# Altium schematic sheet 精简版双路驱动.SchDoc
size A3
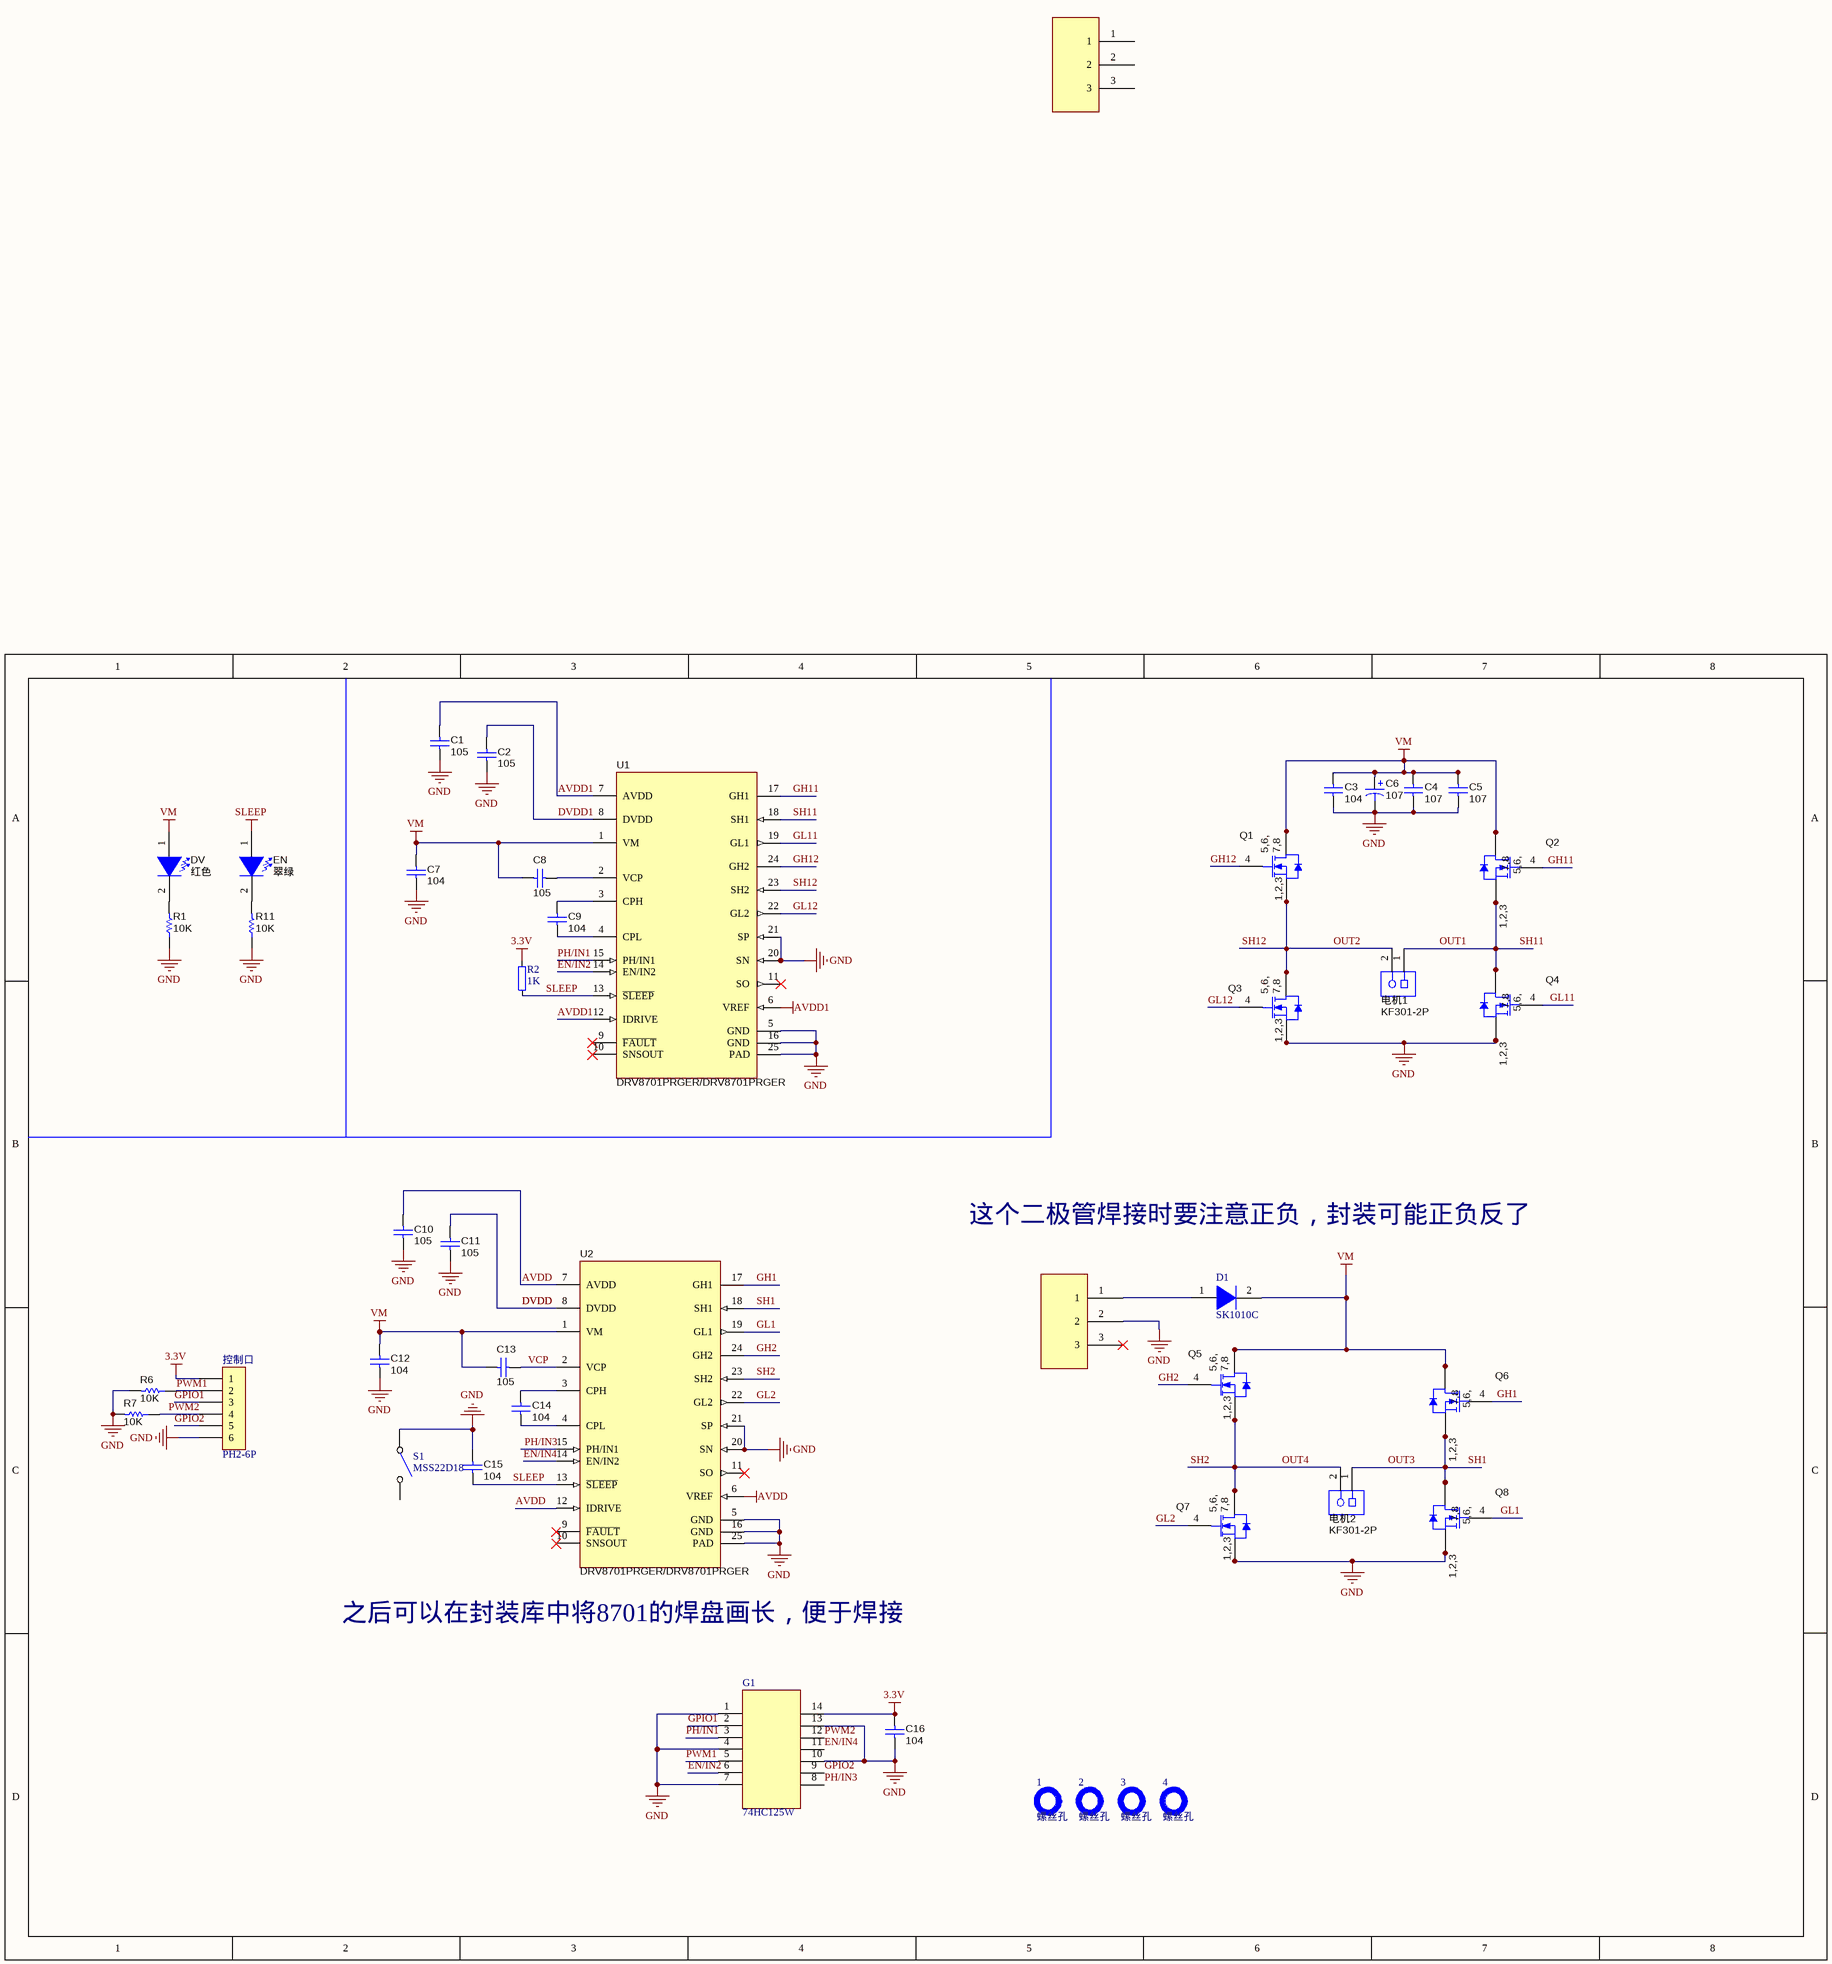
[diagram p0: 精简版双路驱动.SchDoc]

## Parts
(Parts that share a designator on the sheet are numbered #1, #2 ... from top to bottom, then left to right.)
1  螺丝孔  [LQ_SCROW3&5MM]
2  螺丝孔  [LQ_SCROW3&5MM]
3  螺丝孔  [LQ_SCROW3&5MM]
4  螺丝孔  [LQ_SCROW3&5MM]
*#1  DC接口  (value not drawn)  (part B of 2)
*#2  DC接口  (value not drawn)  (part A of 2)
C1  105  [LQ_C0603]
C2  105  [LQ_C0603]
C3  104  [LQ_C0603]
C4  107  [LQ_C1210]
C5  107  [LQ_C1210]
C6  107  [LQ_C1210]
C7  104  [LQ_C0603]
C8  105  [LQ_C0603]
C9  104  [LQ_C0603]
C10  105  [LQ_C0603]
C11  105  [LQ_C0603]
C12  104  [LQ_C0603]
C13  105  [LQ_C0603]
C14  104  [LQ_C0603]
C15  104  [LQ_C0603]
C16  104  [LQ_C0603]
D1  SK1010C  [LQ_DSMC-DO-214AB]
DV  红色  [LQ_LED0603R]
EN  翠绿  [LQ_LED0603R]
G1  74HC125W  [TSOP65P640X110-14N]
J1  DC接口  [DC-005]  (value not drawn)  (part B of 2)
Q1  TPH1R403NL/CSD18532Q5B  [LQ_SON5X6]  (value not drawn)
Q2  TPH1R403NL/CSD18532Q5B  [LQ_SON5X6]  (value not drawn)
Q3  TPH1R403NL/CSD18532Q5B  [LQ_SON5X6]  (value not drawn)
Q4  TPH1R403NL/CSD18532Q5B  [LQ_SON5X6]  (value not drawn)
Q5  TPH1R403NL/CSD18532Q5B  [LQ_SON5X6]  (value not drawn)
Q6  TPH1R403NL/CSD18532Q5B  [LQ_SON5X6]  (value not drawn)
Q7  TPH1R403NL/CSD18532Q5B  [LQ_SON5X6]  (value not drawn)
Q8  TPH1R403NL/CSD18532Q5B  [LQ_SON5X6]  (value not drawn)
R1  10K  [LQ_R0603]
R2  1K  [LQ_R0603]
R6  10K  [LQ_R0603]
R7  10K  [LQ_R0603]
R11  10K  [LQ_R0603]
S1  MSS22D18  [LQ_SW_MSS22D18]
U1  DRV8701PRGER/DRV8701PRGER  [RGE0024F]
U2  DRV8701PRGER/DRV8701PRGER  [RGE0024F]
控制口  PH2-6P  [LQ_PH2.0-WI-6P]
电机1  KF301-2P  [TX60-LI-S]
电机2  KF301-2P  [TX60-LI-S]

## Nets
3.3V: C16.1 G1.14 R2.2 控制口.1
AVDD: C10.1 U2.6(VREF) U2.7(AVDD) U2.12(IDRIVE)
AVDD1: C1.1 U1.6(VREF) U1.7(AVDD) U1.12(IDRIVE)
GND: C1.2 C2.2 C3.2 C4.2 C5.2 C6.2(-) C7.2 C10.2 C11.2 C12.2 C15.1 C16.2 G1.1 G1.4 G1.7 G1.10 G1.13 J1.2 Q3.1(S) Q3.2(S) Q3.3(S) Q4.1(S) Q4.2(S) Q4.3(S) Q7.1(S) Q7.2(S) Q7.3(S) Q8.1(S) Q8.2(S) Q8.3(S) R1.1 R6.2 R7.2 R11.1 S1.1(COMMON) U1.5(GND) U1.16(GND) U1.20(SN) U1.21(SP) U1.25(PAD) U2.5(GND) U2.16(GND) U2.20(SN) U2.21(SP) U2.25(PAD) 控制口.6
SLEEP: C15.2 EN.1(A) R2.1 U1.13(~{SLEEP}) U2.13(~{SLEEP})
VM: C3.1 C4.1 C5.1 C6.1(+) C7.1 C8.2 C12.1 C13.2 D1.2(K) DV.1(A) Q1.5(D) Q1.6(D) Q1.7(D) Q1.8(D) Q2.5(D) Q2.6(D) Q2.7(D) Q2.8(D) Q5.5(D) Q5.6(D) Q5.7(D) Q5.8(D) Q6.5(D) Q6.6(D) Q6.7(D) Q6.8(D) U1.1(VM) U2.1(VM)
DVDD: C11.1 U2.8(DVDD)
DVDD1: C2.1 U1.8(DVDD)
EN/IN2: G1.6 U1.14(EN/IN2)
EN/IN4: G1.11 U2.14(EN/IN2)
GH1: Q6.4(G) U2.17(GH1)
GH2: Q5.4(G) U2.24(GH2)
GH11: Q2.4(G) U1.17(GH1)
GH12: Q1.4(G) U1.24(GH2)
GL1: Q8.4(G) U2.19(GL1)
GL2: Q7.4(G) U2.22(GL2)
GL11: Q4.4(G) U1.19(GL1)
GL12: Q3.4(G) U1.22(GL2)
GPIO1: G1.2 控制口.3
GPIO2: G1.9 控制口.5
OUT1: Q2.1(S) Q2.2(S) Q2.3(S) Q4.5(D) Q4.6(D) Q4.7(D) Q4.8(D) U1.18(SH1) 电机1.1  [also labelled SH11]
OUT2: Q1.1(S) Q1.2(S) Q1.3(S) Q3.5(D) Q3.6(D) Q3.7(D) Q3.8(D) U1.23(SH2) 电机1.2  [also labelled SH12]
OUT3: Q6.1(S) Q6.2(S) Q6.3(S) Q8.5(D) Q8.6(D) Q8.7(D) Q8.8(D) U2.18(SH1) 电机2.1  [also labelled SH1]
OUT4: Q5.1(S) Q5.2(S) Q5.3(S) Q7.5(D) Q7.6(D) Q7.7(D) Q7.8(D) U2.23(SH2) 电机2.2  [also labelled SH2]
PH/IN1: G1.3 U1.15(PH/IN1)
PH/IN3: G1.8 U2.15(PH/IN1)
PWM1: G1.5 R6.1 控制口.2
PWM2: G1.12 R7.1 控制口.4
VCP: C13.1 U2.2(VCP)
NetC8_1: C8.1 U1.2(VCP)
NetC9_1: C9.1 U1.3(CPH)
NetC9_2: C9.2 U1.4(CPL)
NetC14_1: C14.1 U2.3(CPH)
NetC14_2: C14.2 U2.4(CPL)
NetD1_1: D1.1(A) J1.1
NetDV_2: DV.2(K) R1.2
NetEN_2: EN.2(K) R11.2

Not connected (* = marked no-connect by the designer): *#1 1 2 3; J1 3*; S1 2(NO); U1 9(~{FAULT})* 10(SNSOUT)* 11(SO)*; U2 9(~{FAULT})* 10(SNSOUT)* 11(SO)*

## Notes on the sheet
- 这个二极管焊接时要注意正负，封装可能正负反了
- 之后可以在封装库中将8701的焊盘画长，便于焊接
- (in symbol CSD18532Q5B) 7,8; 5,6,; 1,2,3

## Library data of the parts
C1 C2 C8 C10 C11 C13 = GRM188R70J105KA01D: Manufacturer: MuRata; Polarized: N; CompType: Capacitor; Value: 1uF; ValueDisplayed: 1µF; U/M: EA; Cap_F: 0.000001; Tolerance_%: 10; Value1: Unknown; VDC_V: 6.3; Value2: 6.3V; TempCo: X7R; TaMin_C: -55; TaMax_C: 125; Cap_Case: 0603; SymbolVersion: 2008-07-09; PartNumber: GRM188R70J105KA01D; PackageReference: 0603; RoHS: Y; MountType: SMT; Technology: Ceramic; Published: 2008-06-19; Publisher: Texas Instruments; LatestRevisionDate: 2014-05-28; ComponentLink1Description: Datasheet link; ComponentLink1URL: http://search.murata.co.jp/Ceramy/PnsearchViewAction.do?HnOFG=ON&HnNFG=ON&SEL_CNT=50&sLang=en&sKey=GRM188R70J105KA01D&x=9&y=9&search=startwith; Supplier 1: Digi-Key; Supplier Part Number 1: 490-3898-1-ND; Supplier 2: Mouser; Supplier Part Number 2: 81-GRM188R70J105KA01; Supplier 3: Farnell; Supplier Part Number 3: 1845765
C3-C5 C7 C9 C12 C14-C16 = GRM21BR71H105KA12L: Manufacturer: MuRata; Polarized: N; CompType: Capacitor; Value: 1uF; ValueDisplayed: 1µF; U/M: EA; Cap_F: 0.000001; Tolerance_%: 10; Value1: Unknown; VDC_V: 50; Value2: 50V; TempCo: X7R; TaMin_C: -55; TaMax_C: 125; Cap_Case: 0805; SymbolVersion: 2008-07-09; PartNumber: GRM21BR71H105KA12L; PackageReference: 0805; RoHS: Y; MountType: SMT; Technology: Ceramic; Published: 2008-06-19; Publisher: Texas Instruments; LatestRevisionDate: 2013-09-06; ComponentLink1Description: Datasheet link; ComponentLink1URL: http://search.murata.co.jp/Ceramy/PnsearchViewAction.do?HnOFG=ON&HnNFG=ON&SEL_CNT=50&sLang=en&sKey=GRM21BR71H105KA12L&x=9&y=9&search=startwith; Supplier 1: Digi-Key; Supplier Part Number 1: 490-4736-1-ND; Supplier 2: Mouser; Supplier Part Number 2: 81-GRM21BR71H105KA2L; Supplier 3: Farnell; Supplier Part Number 3: 1735541
C6 = ECA-1HM471: Manufacturer: Panasonic; Polarized: Y; CompType: Capacitor; Value: 470uF; ValueDisplayed: 330µF/35V; U/M: EA; Cap_F: 0.00047; Tolerance_%: 20; Value1: Unknown; VDC_V: 50; Value2: 50V; IRMS_A: 0.65; TaMin_C: -40; TaMax_C: 85; Cap_Case: 10x20mm; SymbolVersion: 2008-07-09; PartNumber: ECA-1HM471; PackageReference: D10xL20mm; RoHS: Y; MountType: TH; Technology: AL; Series: M; Publisher: Texas Instruments; LatestRevisionDate: 2015-02-10; ComponentLink1Description: Datasheet link; ComponentLink1URL: http://industrial.panasonic.com/www-data/pdf/ABA0000/ABA0000CE12.pdf; Supplier 1: Digi-Key; Supplier Part Number 1: P5185-ND; Supplier 2: Mouser; Supplier Part Number 2: 667-ECA-1HM471; Supplier 3: Farnell; Supplier Part Number 3: 9693815
DV EN = LTST-C171GKT: Manufacturer: Lite-On; CompType: LED; Value: Green; Vf_V: 2.1; Value2: 2.1V; Io_A: 20; Value1: W; U/M: EA; PartNumber: LTST-C171GKT; SymbolVersion: 2008-12-08; MountType: SMT; RoHS: Y; PackageReference: LED_0805; Type: AlInGaP; Color: green; Published: 2008-07-11; Publisher: Texas Instruments; ComponentLink1URL: https://sps06.itg.ti.com/sites/KMS/crossdivteams/altium/docs/ComponentDatasheets/LTST-C171GKT.pdf; ComponentLink1Description: Datasheet link; LatestRevisionDate: 2013-09-07; Supplier 1: Digi-Key; Supplier Part Number 1: 160-1423-1-ND; Supplier 2: Mouser; Supplier Part Number 2: 859-LTST-C171GKT
Q1-Q8 = CSD18532Q5B: Manufacturer: Texas Instruments; Alternate Manufacturer: None; CompType: MOSFET; U/M: EA; ChType: N; Value: 60V; VdsMax_V: 60; Value1: 3.3 ohm; Rdson45_Ohm: 3.3; Value2: 27 nC; QgTyp_nC: 27; Vgs_V: 1.6; IdsMax_A: 172; SymbolVersion: 2008-07-09; PartNumber: CSD18532Q5B; PackageReference: SON 5x6mm; RoHS: Y; MountType: SMT; Published: 2008-06-19; Publisher: Texas Instruments; LatestRevisionDate: 2014-05-23; LatestRevisionNote: Added parts.; ComponentLink1Description: Datasheet link; ComponentLink1URL: http://www.ti.com/lit/gpn/csd18532q5b; Supplier 1: Digi-Key; Supplier Part Number 1: 296-35628-1-ND; Supplier 2: Mouser; Supplier Part Number 2: 595-CSD18532Q5B; Supplier 3: Newark; Supplier Part Number 3: 63W5308
R1 R6 R7 R11 = CRCW06034K99FKEA: Manufacturer: Vishay-Dale; CompType: Resistor; Res_ohm: 4990; Value_Code: 4k99; Tolerance_%: 1; Value1: 1%; Power_W: 0.1; Value2: 0.1W; VDC_V: 75; TempCo: 100 ppm/C; EIA_Code: E96; U/M: EA; SymbolVersion: 2009-05-29; Value: 10K; PartNumber: CRCW06034K99FKEA; PackageReference: 0603; RoHS: Y; MountType: SMT; Technology: Thick Film; Published: 2008-06-26; Publisher: Texas Instruments; LatestRevisionDate: 2013-10-22; ComponentLink1Description: Datasheet link; ComponentLink1URL: http://www.vishay.com/docs/20035/dcrcwe3.pdf; Supplier 1: Digi-Key; Supplier Part Number 1: 541-4.99KHCT-ND; Supplier 2: Mouser; Supplier Part Number 2: 71-CRCW0603-4.99K-E3; Supplier 3: Farnell; Supplier Part Number 3: 1652885
R2 = RES
S1 = SW SPST
U1 U2 = DRV8701ERGER: Alternate PartNumber: DRV8701ERGET; Manufacturer: Texas Instruments; SymbolCreator: Altium; CompType: IC; U/M: EA; SymbolVersion: 2015-02-10; PartNumber: DRV8701ERGER; PackageReference: RGE0024F; MountType: SMT; ComponentLink1Description: Datasheet Link; ComponentLink1URL: https://sps06.itg.ti.com/sites/KMS/crossdivteams/altium/docs/ComponentDatasheets/DRV8701_011615.pdf; Publisher: Texas Instruments; LatestRevisionDate: 2015-02-10; Alternate Manufacturer: Texas Instruments
控制口 = 控制口
电机1 电机2 = 691 101 710 002: Manufacturer: Wurth Elektronik eiSos; SymbolCreator: a0412235; CompType: Terminal Block; U/M: EA; SymbolVersion: 2013-09-04; PartNumber: 691 101 710 002; PackageReference: Terminal Block, 5 mm, 2x1, TH; RoHS: Y; MountType: TH; ComponentLink1Description: Datasheet Link; ComponentLink1URL: http://katalog.we-online.de/em/datasheet/6911017100xx.pdf; Publisher: Texas Instruments; LatestRevisionDate: 2015-02-03; Supplier 1: Digi-Key; Supplier Part Number 1: 732-2026-ND; Supplier 2: Mouser; Supplier Part Number 2: 710-691101710002
G1 = 74HC125W: Parameter 1: *